# Altium project ATOL_POWER_BOARD_R02A03_20191009.PrjPcb
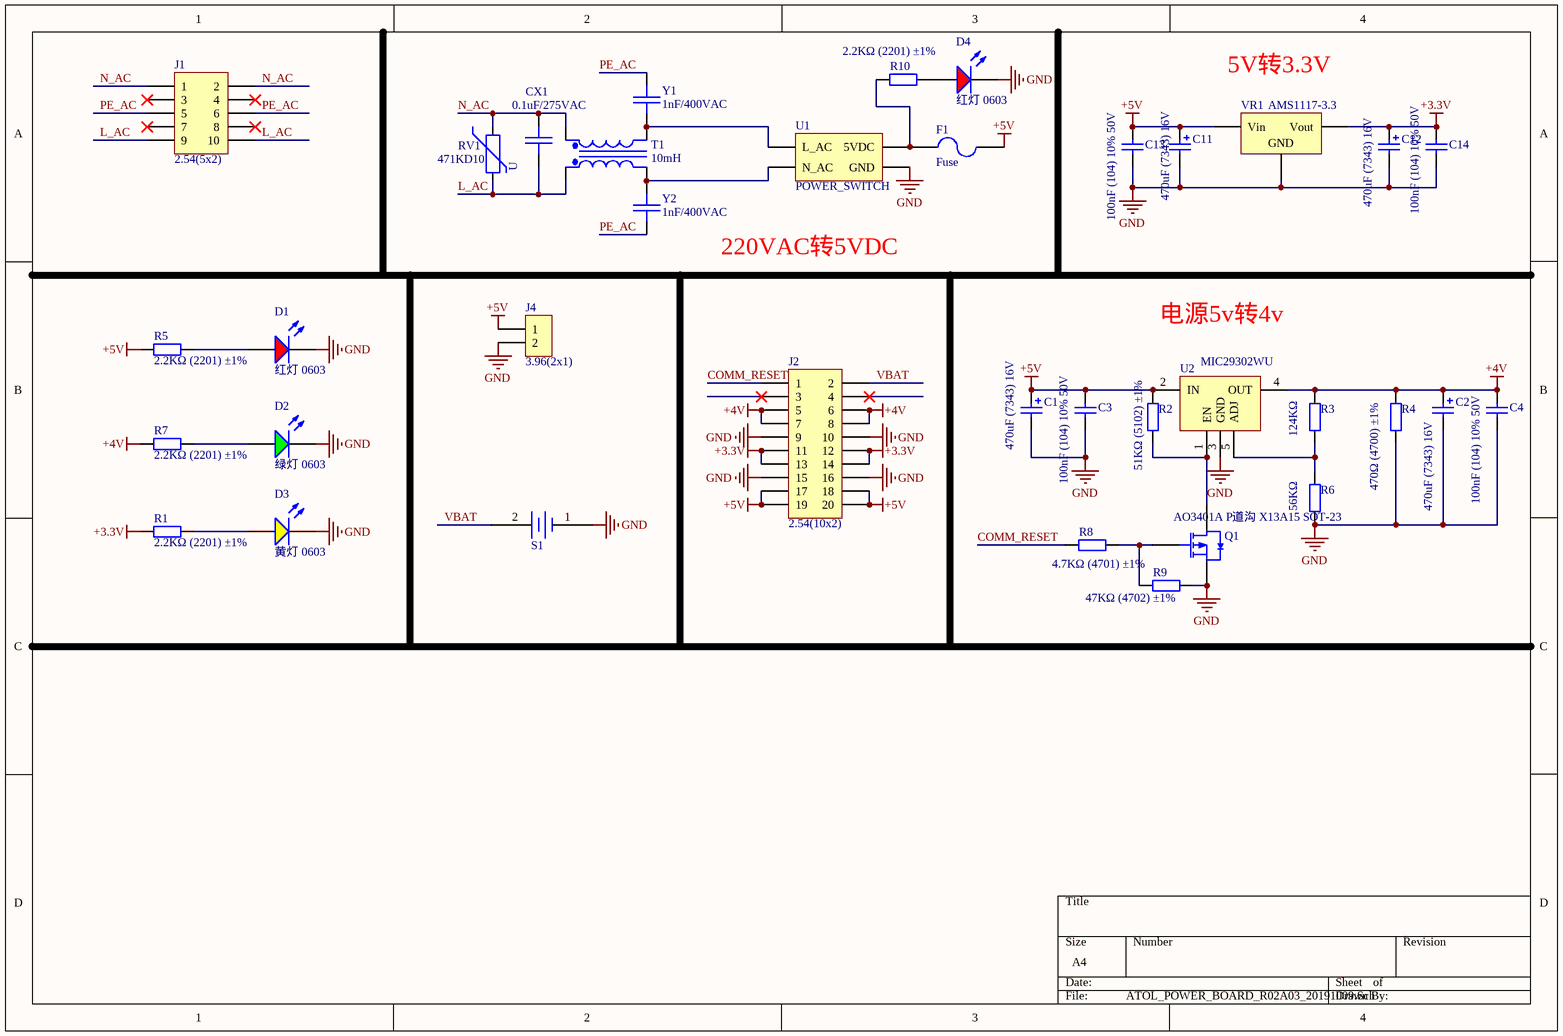
[diagram p0: ATOL_POWER_BOARD_R02A03_20191009.SchDoc]
1 sheet, 36 parts. Net scope: global (net labels, ports and power ports of the same name join across sheets).
Board file: ATOL_POWER_BOARD_R02A03_20191009.PcbDoc

## Sheet ATOL_POWER_BOARD_R02A03_20191009.SchDoc
size A4

### Parts
C1  470uF (7343) 16V  [STEC_E(7343-43)]
C2  470uF (7343) 16V  [STEC_E(7343-43)]
C3  100nF (104) 10% 50V  [0603_C]
C4  100nF (104) 10% 50V  [0603_C]
C11  470uF (7343) 16V  [STEC_E(7343-43)]
C12  470uF (7343) 16V  [STEC_E(7343-43)]
C13  100nF (104) 10% 50V  [0603_C]
C14  100nF (104) 10% 50V  [0603_C]
CX1  0.1uF/275VAC  [X2-0.1U]
D1  红灯 0603  [0603_LED_S1]
D2  绿灯 0603  [0603_LED_S1]
D3  黄灯 0603  [0603_LED_S1]
D4  红灯 0603  [0603_LED_S1]
F1  Fuse  [1206R]
J1  2.54(5x2)  [DB2.54(5x2)]
J2  2.54(10x2)  [DB2.54(10x2)]
J4  3.96(2x1)  [HT3.96-WI-2P]
Q1  AO3401A P道沟 X13A15 SOT-23  [SOT-23-3L]
R1  2.2KΩ (2201) ±1%  [0603_R]
R2  51KΩ (5102) ±1%  [0603_R]
R3  124KΩ  [0603_R]
R4  470Ω (4700) ±1%  [0603_R]
R5  2.2KΩ (2201) ±1%  [0603_R]
R6  56KΩ  [0603_R]
R7  2.2KΩ (2201) ±1%  [0603_R]
R8  4.7KΩ (4701) ±1%  [0603_R]
R9  47KΩ (4702) ±1%  [0603_R]
R10  2.2KΩ (2201) ±1%  [0603_R]
RV1  471KD10  [RV-14K]
S1  3V电池  [BATM-1220]  (value not drawn)
T1  10mH  [L-GM]
U1  POWER_SWITCH  [POWER_HILINK]
U2  MIC29302WU  [LM2596]
VR1  AMS1117-3.3  [SOT-223]
Y1  1nF/400VAC  [X2-1n]
Y2  1nF/400VAC  [X2-1n]

### Nets
+3.3V: C12.1 C14.2 J2.11 J2.12 J2.13 J2.14 R1.1 VR1.2(Vout)
+4V: C2.1 C4.2 J2.5 J2.6 J2.7 J2.8 R3.2 R4.2 R7.1 U2.4(OUT)
+5V: C1.1 C3.2 C11.1 C13.2 F1.2 J2.17 J2.18 J2.19 J2.20 J4.1 R2.2 R5.1 U2.2(IN) VR1.3(Vin)
GND: C1.2 C2.2 C3.1 C4.1 C11.2 C12.2 C13.1 C14.1 D1.K D2.K D3.K D4.K J2.9 J2.10 J2.15 J2.16 J4.2 Q1.2(S) R4.1 R6.1 R9.2 S1.1 U1.3(GND) U2.3(GND) VR1.1(GND)
COMM_RESET: J2.1 R8.1
L_AC: CX1.1 J1.9 J1.10 RV1.1 T1.1
N_AC: CX1.2 J1.1 J1.2 RV1.2 T1.3
PE_AC: J1.5 J1.6 Y1.2 Y2.2
VBAT: J2.2 S1.2
NetD1_A: D1.A R5.2
NetD2_A: D2.A R7.2
NetD3_A: D3.A R1.2
NetD4_A: D4.A R10.2
NetF1_1: F1.1 R10.1 U1.4(5VDC)
NetQ1_1: Q1.1(G) R8.2 R9.1
NetQ1_3: Q1.3(D) R2.1 U2.1(EN)
NetR3_1: R3.1 R6.2 U2.5(ADJ)
NetT1_2: T1.2 U1.2(N_AC) Y2.1
NetT1_4: T1.4 U1.1(L_AC) Y1.1

Not connected (* = marked no-connect by the designer): J1 3* 4* 7* 8*; J2 3* 4*

### Notes on the sheet
- (near VR1) 5V转3.3V
- 220VAC转5VDC
- 电源5v转4v
- (in symbol MOV) U

### Library data of the parts
C1 C2 C11 C12 = 3528 100uF (107) 10% 6.3V: 钽电容; ComponentLink1Description: 供应商链接; ComponentLink1URL: http://www.szlcsc.com/product/details_16815.html; Package: 3528; Supplier: LC; SuppliersPartNumber: C16133
C3 C4 C13 C14 = 0603 100nF (104) 10% 50V: 贴片电容; ComponentLink1Description: 供应商链接; ComponentLink1URL: http://www.szlcsc.com/product/details_15331.html; Package: 0603; Supplier: LC; SuppliersPartNumber: C14663
CX1 Y1 Y2 = CAP: 普通电容
D1 D4 = 0603 红灯: 发光二极管; ComponentLink1Description: 供应商链接; ComponentLink1URL: http://www.szlcsc.com/product/details_2659.html; Package: 0603; Supplier: LC; SuppliersPartNumber: C2286
D2 = 0603 绿灯: 发光二极管; ComponentLink1Description: 供应商链接; ComponentLink1URL: http://www.szlcsc.com/product/details_73152.html; Package: 0603; Supplier: LC; SuppliersPartNumber: C72043
D3 = 0603 黄灯: 发光二极管; ComponentLink1Description: 供应商链接; ComponentLink1URL: http://www.szlcsc.com/product/details_73147.html; Package: 0603; Supplier: LC; SuppliersPartNumber: C72038
F1 = Fuse: 保险丝; Published: 8-Jun-2000; LatestRevisionDate: 17-Jul-2002; LatestRevisionNote: Re-released for DXP Platform.; PackageReference: PIN-W2/E2.8; Publisher: Altium Limited; PackageDescription: Thru-Hole; 2 Leads
J1 = 2.54(5x2): 2.54端子
J2 = 2.54(10x2): 2.54端子
J4 = 3.96(2x1): 3.96端子
Q1 = AO3401A P道沟 X13A15 SOT-23: MOS(场效应管); ComponentLink1Description: 供应商链接; ComponentLink1URL: http://www.szlcsc.com/product/details_15801.html; Package: SOT-23; Supplier: LC; SuppliersPartNumber: C15127
R1 R5 R7 R10 = 0603 2.2KΩ (2201) 1%: 贴片电阻; ComponentLink1Description: 供应商链接; ComponentLink1URL: http://www.szlcsc.com/product/details_4597.html; Package: 0603; Supplier: LC; SuppliersPartNumber: C4190
R2 R3 R6 = 0603 51KΩ (5102) 1%: 贴片电阻; ComponentLink1Description: 供应商链接; ComponentLink1URL: http://www.szlcsc.com/product/details_23923.html; Package: 0603; Supplier: LC; SuppliersPartNumber: C23196
R4 = 0603 470Ω (4700) 1%: 贴片电阻; ComponentLink1Description: 供应商链接; ComponentLink1URL: http://www.szlcsc.com/product/details_23906.html; Package: 0603; Supplier: LC; SuppliersPartNumber: C23179
R8 = 0603 4.7KΩ (4701) 1%: 贴片电阻; ComponentLink1Description: 供应商链接; ComponentLink1URL: http://www.szlcsc.com/product/details_23889.html; Package: 0603; Supplier: LC; SuppliersPartNumber: C23162
R9 = 0603 47KΩ (4702) 1%: 贴片电阻; ComponentLink1Description: 供应商链接; ComponentLink1URL: http://www.szlcsc.com/product/details_26562.html; Package: 0603; Supplier: LC; SuppliersPartNumber: C25819
RV1 = MOV: 压敏电阻
T1 = Trans Ideal: Transformer (Ideal); Published: *; LatestRevisionDate: *; LatestRevisionNote: *; PackageReference: *; Publisher: *
U1 = POWER_SWITCH: POWER_SWITCH_220VAC_5VDC
U2 = MIC29302WU: POWER
VR1 = SOT-223 AMS1117-3.3: 低压差线性稳压(LDO); ComponentLink1Description: 供应商链接; ComponentLink1URL: http://www.szlcsc.com/product/details_6652.html; Package: SOT-223; Supplier: LC; SuppliersPartNumber: C6186